# Altium schematic sheet UartsAndGPS.SchDoc
size A4
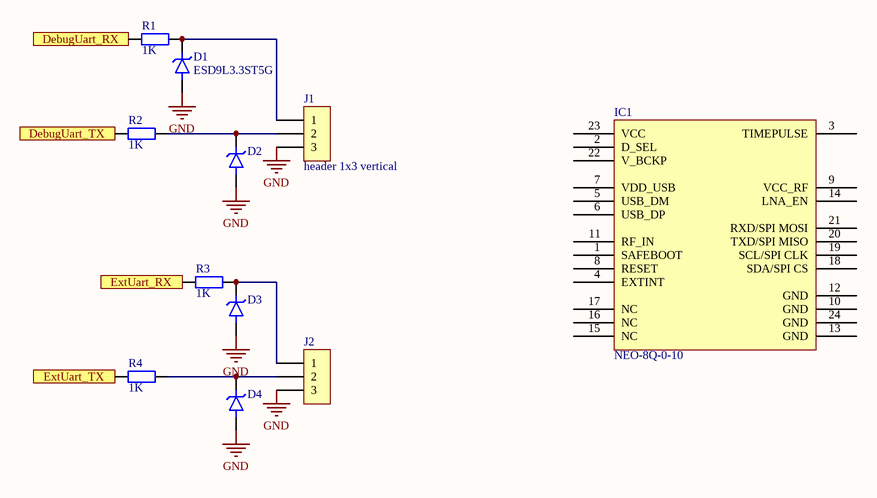
[diagram p0: UartsAndGPS.SchDoc]

## Parts
D1  ESD9L3.3ST5G  [SOD923F, NOMINAL]
D2  ESD9L3.3ST5G  [SOD923F, NOMINAL]  (value not drawn)
D3  ESD9L3.3ST5G  [SOD923F, NOMINAL]  (value not drawn)
D4  ESD9L3.3ST5G  [SOD923F, NOMINAL]  (value not drawn)
IC1  NEO-8Q-0-10  [NEO-8Q]
J1  header 1x3 vertical  [UART_HEADER]
J2  header 1x3 vertical  [UART_HEADER]  (value not drawn)
R1  1K  [R0603]
R2  1K  [R0603]
R3  1K  [R0603]
R4  1K  [R0603]

## Ports
DebugUart_RX (out), DebugUart_TX (in), ExtUart_RX (out), ExtUart_TX (in)

## Nets
GND: D1.A D2.A D3.A D4.A J1.3 J2.3
DebugUart_RX: R1.2 ; port DebugUart_RX
DebugUart_TX: R2.2 ; port DebugUart_TX
ExtUart_RX: R3.2 ; port ExtUart_RX
ExtUart_TX: R4.2 ; port ExtUart_TX
NetD1_C: D1.C J1.1 R1.1
NetD2_C: D2.C J1.2 R2.1
NetD3_C: D3.C J2.1 R3.1
NetD4_C: D4.C J2.2 R4.1

Not connected (* = marked no-connect by the designer): IC1 1(SAFEBOOT) 2(D_SEL) 3(TIMEPULSE) 4(EXTINT) 5(USB_DM) 6(USB_DP) 7(VDD_USB) 8(RESET) 9(VCC_RF) 10(GND) 11(RF_IN) 12(GND) 13(GND) 14(LNA_EN) 15(NC) 16(NC) 17(NC) 18(SDA/SPI_CS) 19(SCL/SPI_CLK) 20(TXD/SPI_MISO) 21(RXD/SPI_MOSI) 22(V_BCKP) 23(VCC) 24(GND)

## Library data of the parts
D1-D4 = ESD9L3.3ST5G: TVS DIODE, Unidir, 3.3V/9V, 150mW, SOD-923, ESD9L3.3ST5G, ON SEMICONDUCTOR; Clamping Voltage: 9V; Reverse Standoff Voltage: 3.3V; Breakdown Voltage: 4.8V; Peak Pulse Current: 1A; Leakage Current: 1uA; Supplier 1: Farnell; Manufacturer: ON Semiconductor; Manufacturer Part Number: ESD9L3.3ST5G; Case/Package: SOD-923-2; Operating Temperature Range: -55 .. 125°C; Peak Pulse Power: 150mW; ComponentLink1URL: https://www.verical.com/server-webapp/html/getDatasheet?partID=148186&src-supplier=Verical; ComponentLink1Description: Datasheet; Supplier Part Number 1: 2533269
IC1 = NEO-8Q: GPS GLONASS module, +-2m, -166dBm, 2.7..3.6Vin; ComponentLink1Description: Datasheet; ComponentLink1URL: https://www.tme.eu/Document/711fdb8d27953350f4ac6d29611b5f94/NEO-8Q_DataSheet.pdf
R1-R4 = Resistor: Precision: *%; Voltage rating: *V; Temp coefficient: *ppm; Power rating: *mW; Manufacturer: *; Resistance: 1K; Note: R0603